# Altium schematic sheet Sheet1.SchDoc
size A4
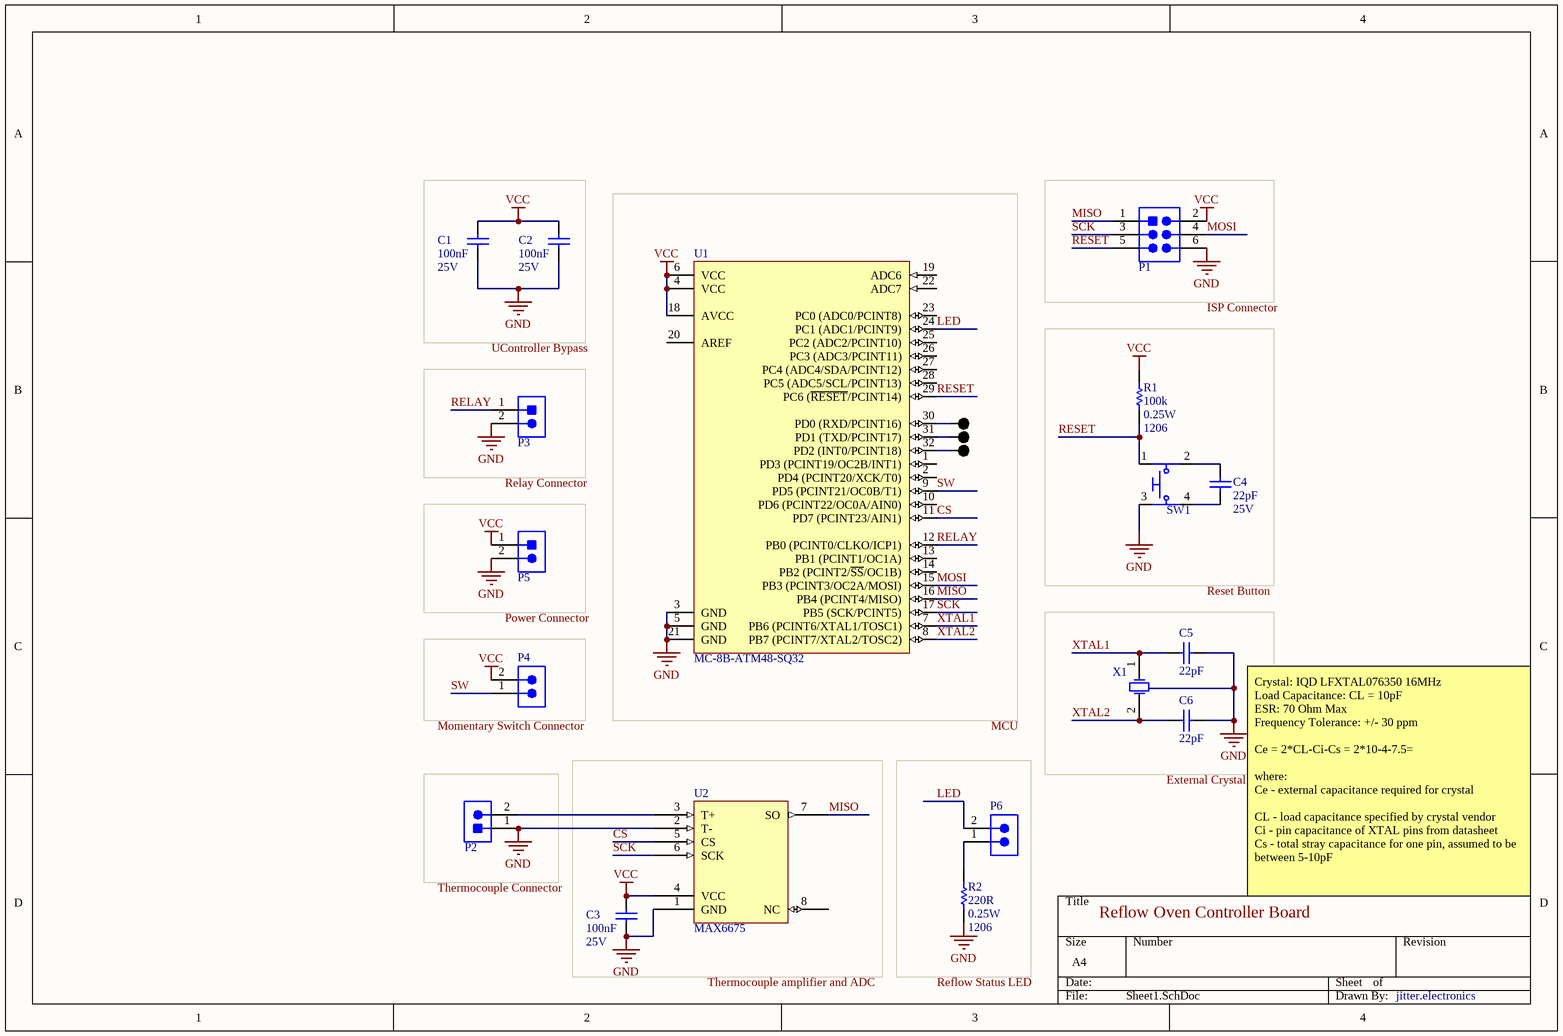
[diagram p0: Sheet1.SchDoc]

## Parts
1  1MM_HOLE  [1MM_HOLE]  (value not drawn)
2  1MM_HOLE  [1MM_HOLE]  (value not drawn)
3  1MM_HOLE  [1MM_HOLE]  (value not drawn)
C1  value 100nF  VOLTAGE: 25V  [CAPC0805(2012)75_N]  (hidden comment: CAP)
C2  value 100nF  VOLTAGE: 25V  [CAPC0805(2012)75_N]  (hidden comment: CAP)
C3  value 100nF  VOLTAGE: 25V  [CAPC0805(2012)75_N]  (hidden comment: CAP)
C4  value 22pF  VOLTAGE: 25V  [CAPC0805(2012)75_N]  (hidden comment: CAP)
C5  value 22pF  [CAPC0805(2012)75_N]  (hidden comment: CAP)
C6  value 22pF  [CAPC0805(2012)75_N]  (hidden comment: CAP)
P1  2X3-2.54mm-HEADER  [PCE-BH2542-10-SPGRH-3.0]  (value not drawn)
P2  CTBP5000/2  [Camden Boss CTBP5000/2]  (value not drawn)
P3  CTBP5000/2  [Camden Boss CTBP5000/2]  (value not drawn)
P4  B2B-XH-A HEADER  [B2B-XH-A]  (value not drawn)
P5  CTBP5000/2  [Camden Boss CTBP5000/2]  (value not drawn)
P6  B2B-XH-A HEADER  [B2B-XH-A]  (value not drawn)
R1  value 100k  RATING: 0.25W  FOOT: 1206  [RESC1206(3216)_N]  (hidden comment: RES)
R2  value 220R  RATING: 0.25W  FOOT: 1206  [RESC1206(3216)_N]  (hidden comment: RES)
SW1  SW-SPST-4_A  [sw_PB_SMD]  (value not drawn)
U1  MC-8B-ATM48-SQ32  [32A_L]
U2  MAX6675  [D0008A_N]
X1  LFXTAL076350  [LFXTAL076350]  (value not drawn)

## Blocks framed on the sheet
ISP Connector: C4 R1 SW1
UController Bypass: P3
Relay Connector: P5
Reset Button: C5 C6 X1
Power Connector: P4

## Nets
GND: C1.1 C2.1 C3.1 C5.1 C6.1 P1.6 P2.1 P3.2 P5.2 R2.2 SW1.3 U1.3(GND) U1.5(GND) U1.21(GND) U2.1(GND) U2.2(T-) X1.3(GND)
VCC: C1.2 C2.2 C3.2 P1.2 P4.2 P5.1 R1.2 U1.4(VCC) U1.6(VCC) U1.18(AVCC) U2.4(VCC)
CS: U1.11(PD7_(PCINT23/AIN1)) U2.5(CS)
LED: P6.2 U1.24(PC1_(ADC1/PCINT9))
MISO: P1.1 U1.16(PB4_(PCINT4/MISO)) U2.7(SO)
MOSI: P1.4 U1.15(PB3_(PCINT3/OC2A/MOSI))
RELAY: P3.1 U1.12(PB0_(PCINT0/CLKO/ICP1))
RESET: P1.5 R1.1 SW1.1 U1.29(PC6_(~{RESET}/PCINT14))
SCK: P1.3 U1.17(PB5_(SCK/PCINT5)) U2.6(SCK)
SW: P4.1 U1.9(PD5_(PCINT21/OC0B/T1))
XTAL1: C5.2 U1.7(PB6_(PCINT6/XTAL1/TOSC1)) X1.1(X2)
XTAL2: C6.2 U1.8(PB7_(PCINT7/XTAL2/TOSC2)) X1.2(X1)
Net1_1: 1.1 U1.30(PD0_(RXD/PCINT16))
Net2_1: 2.1 U1.31(PD1_(TXD/PCINT17))
Net3_1: 3.1 U1.32(PD2_(INT0/PCINT18))
NetC4_1: C4.1 SW1.2
NetC4_2: C4.2 SW1.4
NetP2_2: P2.2 U2.3(T+)
NetP6_1: P6.1 R2.1

Not connected (* = marked no-connect by the designer): U1 1(PD3_(PCINT19/OC2B/INT1)) 2(PD4_(PCINT20/XCK/T0)) 10(PD6_(PCINT22/OC0A/AIN0)) 13(PB1_(PCINT1/OC1A)) 14(PB2_(PCINT2/~{SS}/OC1B)) 19(ADC6) 20(AREF) 22(ADC7) 23(PC0_(ADC0/PCINT8)) 25(PC2_(ADC2/PCINT10)) 26(PC3_(ADC3/PCINT11)) 27(PC4_(ADC4/SDA/PCINT12)) 28(PC5_(ADC5/SCL/PCINT13)); U2 8(NC)

## Notes on the sheet
- (near P4) Momentary Switch Connector
- MCU
- External Crystal Osc
- Thermocouple Connector
- Reflow Oven Controller Board
- Crystal: IQD LFXTAL076350 16MHz
  Load Capacitance: CL = 10pF
  ESR: 70 Ohm Max
  Frequency Tolerance: +/- 30 ppm
  Ce = 2*CL-Ci-Cs = 2*10-4-7.5=
  where:
  Ce - external capacitance required for crystal
  CL - load capacitance specified by crystal vendor
  Ci - pin capacitance of XTAL pins from datasheet
  Cs - total stray capacitance for one pin, assumed to be between 5-10pF
- Thermocouple amplifier and ADC
- Reflow Status LED
- jitter.electronics

## Library data of the parts
1-3 = 1MM_HOLE: 1mm hole and pad for breakouts
C5 C6 = CAP: VOLTAGE: 25V
P1 = 2X3-2.54mm-HEADER: 2x3 2.54mm Header
P2 P3 P5 = CTBP5000/2: Socket, Screw Terminal Block, 2-Leads, Pitch 5mm, 90 Degree Angle, Through-Hole
P4 P6 = B2B-XH-A HEADER: Wire-To-Board Connector, Vertical, 2.5 mm, 2 Contacts, Header, XH Series, Through Hole, 1 Rows
U1 = MC-8B-ATM48-SQ32: ATMEGA 328P
U2 = MAX 6675
X1 = LFXTAL076350: 16MHz SMD crystal